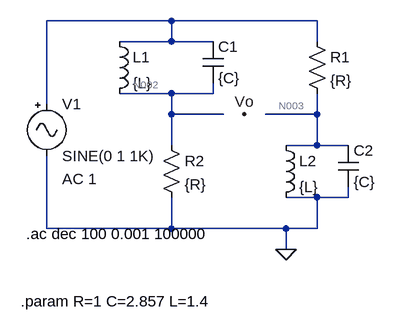
[diagram p0: schematic TS5-Ej2-c.asc]
TS5-Ej2-c.asc, the LTspice schematic file:
Version 4
SHEET 1 880 680
WIRE 160 96 -32 96
WIRE 384 96 160 96
WIRE 160 128 160 96
WIRE 160 128 80 128
WIRE 224 128 160 128
WIRE 384 128 384 96
WIRE 160 208 80 208
WIRE 224 208 224 192
WIRE 224 208 160 208
WIRE -32 224 -32 96
WIRE 160 240 160 208
WIRE 240 240 160 240
WIRE 384 240 384 208
WIRE 384 240 304 240
WIRE 160 288 160 240
WIRE 384 288 384 240
WIRE 384 288 336 288
WIRE 432 288 384 288
WIRE 384 368 336 368
WIRE 432 368 432 352
WIRE 432 368 384 368
WIRE -32 416 -32 304
WIRE 160 416 160 368
WIRE 160 416 -32 416
WIRE 336 416 160 416
WIRE 384 416 384 368
WIRE 384 416 336 416
WIRE 336 448 336 416
FLAG 272 240 Vo
FLAG 336 448 0
SYMBOL Misc\\signal -32 208 R0
WINDOW 123 24 132 Left 2
WINDOW 39 0 0 Left 0
SYMATTR Value2 AC 1
SYMATTR InstName V1
SYMBOL ind 64 112 R0
SYMATTR InstName L1
SYMATTR Value {L}
SYMBOL cap 208 128 R0
SYMATTR InstName C1
SYMATTR Value {C}
SYMBOL res 368 112 R0
SYMATTR InstName R1
SYMATTR Value {R}
SYMBOL res 144 272 R0
SYMATTR InstName R2
SYMATTR Value {R}
SYMBOL ind 320 272 R0
SYMATTR InstName L2
SYMATTR Value {L}
SYMBOL cap 416 288 R0
SYMATTR InstName C2
SYMATTR Value {C}
TEXT -64 424 Left 2 !.ac dec 100 0.001 100000
TEXT -72 528 Left 2 !.param R=1 C=2.857 L=1.4

The netlist it stands for:
* TS5-Ej2-c.asc
V1 N001 0 SINE(0 1 1K) AC 1
L1 N001 N002 {L}
C1 N001 N002 {C}
R1 N001 N003 {R}
R2 N002 0 {R}
L2 N003 0 {L}
C2 N003 0 {C}
.ac dec 100 0.001 100000
.param R=1 C=2.857 L=1.4
.backanno
.end

* Results of the author's LTspice run, read from the files saved beside the schematic
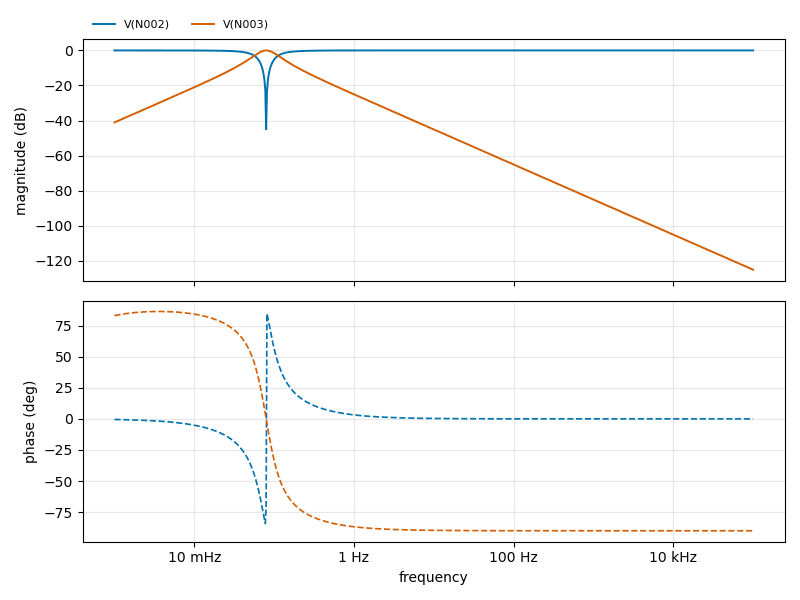
[diagram p1: AC Analysis of TS5-Ej2-c.asc, plotted from the saved traces]
* AC Analysis, 1 run:
*   V(N002): -0.01 dB at 1 mHz, -0.00 dB at 100 kHz, peak -0.00 dB at 100 kHz, 3 dB below the peak at 112.2 mHz
*   V(N003): -41.07 dB at 1 mHz, -125.08 dB at 100 kHz, peak -0.02 dB at 79.43 mHz, 3 dB below the peak at 56.46 mHz and 112.3 mHz